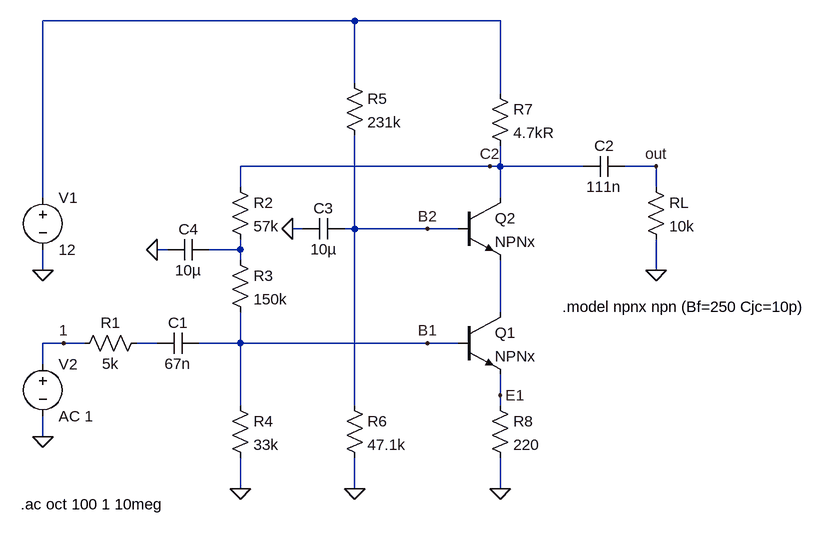
[diagram p0: schematic TV.asc]
TV.asc, the LTspice schematic file:
Version 4
SHEET 1 880 680
WIRE -144 -288 -624 -288
WIRE 80 -288 -144 -288
WIRE -144 -192 -144 -288
WIRE 80 -176 80 -288
WIRE 64 -64 -320 -64
WIRE 80 -64 80 -96
WIRE 80 -64 64 -64
WIRE 208 -64 80 -64
WIRE 320 -64 272 -64
WIRE -320 -32 -320 -64
WIRE 320 -32 320 -64
WIRE -624 -16 -624 -288
WIRE 80 -16 80 -64
WIRE -224 32 -240 32
WIRE -144 32 -144 -112
WIRE -144 32 -160 32
WIRE -32 32 -144 32
WIRE 16 32 -32 32
WIRE -432 64 -448 64
WIRE -320 64 -320 48
WIRE -320 64 -368 64
WIRE -320 80 -320 64
WIRE -624 96 -624 64
WIRE 320 96 320 48
WIRE 80 160 80 80
WIRE -592 208 -624 208
WIRE -560 208 -592 208
WIRE -448 208 -480 208
WIRE -320 208 -320 160
WIRE -320 208 -384 208
WIRE -32 208 -320 208
WIRE 16 208 -32 208
WIRE -624 240 -624 208
WIRE 80 288 80 256
WIRE -320 304 -320 208
WIRE -144 304 -144 32
WIRE 80 304 80 288
WIRE -624 352 -624 320
WIRE -320 432 -320 384
WIRE -144 432 -144 384
WIRE 80 432 80 384
FLAG -624 96 0
FLAG -320 432 0
FLAG -144 432 0
FLAG 80 432 0
FLAG -32 208 B1
FLAG -32 32 B2
FLAG 64 -64 C2
FLAG 80 288 E1
FLAG -624 352 0
FLAG -240 32 0
FLAG -448 64 0
FLAG 320 96 0
FLAG -592 208 1
FLAG 320 -64 out
SYMBOL npn 16 -16 R0
SYMATTR InstName Q2
SYMATTR Value NPNx
SYMBOL npn 16 160 R0
SYMATTR InstName Q1
SYMATTR Value NPNx
SYMBOL res 64 288 R0
SYMATTR InstName R8
SYMATTR Value 220
SYMBOL res 64 -192 R0
SYMATTR InstName R7
SYMATTR Value 4.7kR
SYMBOL res -160 -208 R0
SYMATTR InstName R5
SYMATTR Value 231k
SYMBOL res -160 288 R0
SYMATTR InstName R6
SYMATTR Value 47.1k
SYMBOL res -336 288 R0
SYMATTR InstName R4
SYMATTR Value 33k
SYMBOL res -336 64 R0
SYMATTR InstName R3
SYMATTR Value 150k
SYMBOL res -336 -48 R0
SYMATTR InstName R2
SYMATTR Value 57k
SYMBOL voltage -624 -32 R0
WINDOW 123 0 0 Left 2
WINDOW 39 0 0 Left 2
SYMATTR InstName V1
SYMATTR Value 12
SYMBOL cap -368 48 R90
WINDOW 0 0 32 VBottom 2
WINDOW 3 32 32 VTop 2
SYMATTR InstName C4
SYMATTR Value 10µ
SYMBOL cap -160 16 R90
WINDOW 0 0 32 VBottom 2
WINDOW 3 32 32 VTop 2
SYMATTR InstName C3
SYMATTR Value 10µ
SYMBOL cap 272 -80 R90
WINDOW 0 0 32 VBottom 2
WINDOW 3 32 32 VTop 2
SYMATTR InstName C2
SYMATTR Value 111n
SYMBOL cap -384 192 R90
WINDOW 0 0 32 VBottom 2
WINDOW 3 32 32 VTop 2
SYMATTR InstName C1
SYMATTR Value 67n
SYMBOL res -464 192 R90
WINDOW 0 0 56 VBottom 2
WINDOW 3 32 56 VTop 2
SYMATTR InstName R1
SYMATTR Value 5k
SYMBOL voltage -624 224 R0
WINDOW 123 0 0 Left 2
WINDOW 39 0 0 Left 2
SYMATTR InstName V2
SYMATTR Value AC 1
SYMBOL res 304 -48 R0
SYMATTR InstName RL
SYMATTR Value 10k
TEXT 176 152 Left 2 !.model npnx npn (Bf=250 Cjc=10p)
TEXT -658 456 Left 2 !.ac oct 100 1 10meg

The netlist it stands for:
* TV.asc
Q2 C2 B2 N003 0 NPNx
Q1 N003 B1 E1 0 NPNx
R8 E1 0 220
R7 N001 C2 4.7kR
R5 N001 B2 231k
R6 B2 0 47.1k
R4 B1 0 33k
R3 N002 B1 150k
R2 C2 N002 57k
V1 N001 0 12
C4 N002 0 10µ
C3 B2 0 10µ
C2 out C2 111n
C1 B1 N004 67n
R1 N004 1 5k
V2 1 0 AC 1
RL out 0 10k
.model NPN NPN
.model PNP PNP
.lib standard.bjt
.model npnx npn (Bf=250 Cjc=10p)
.ac oct 100 1 10meg
.backanno
.end